# EAGLE schematic ctia_alone (EAGLE 7.2.0)
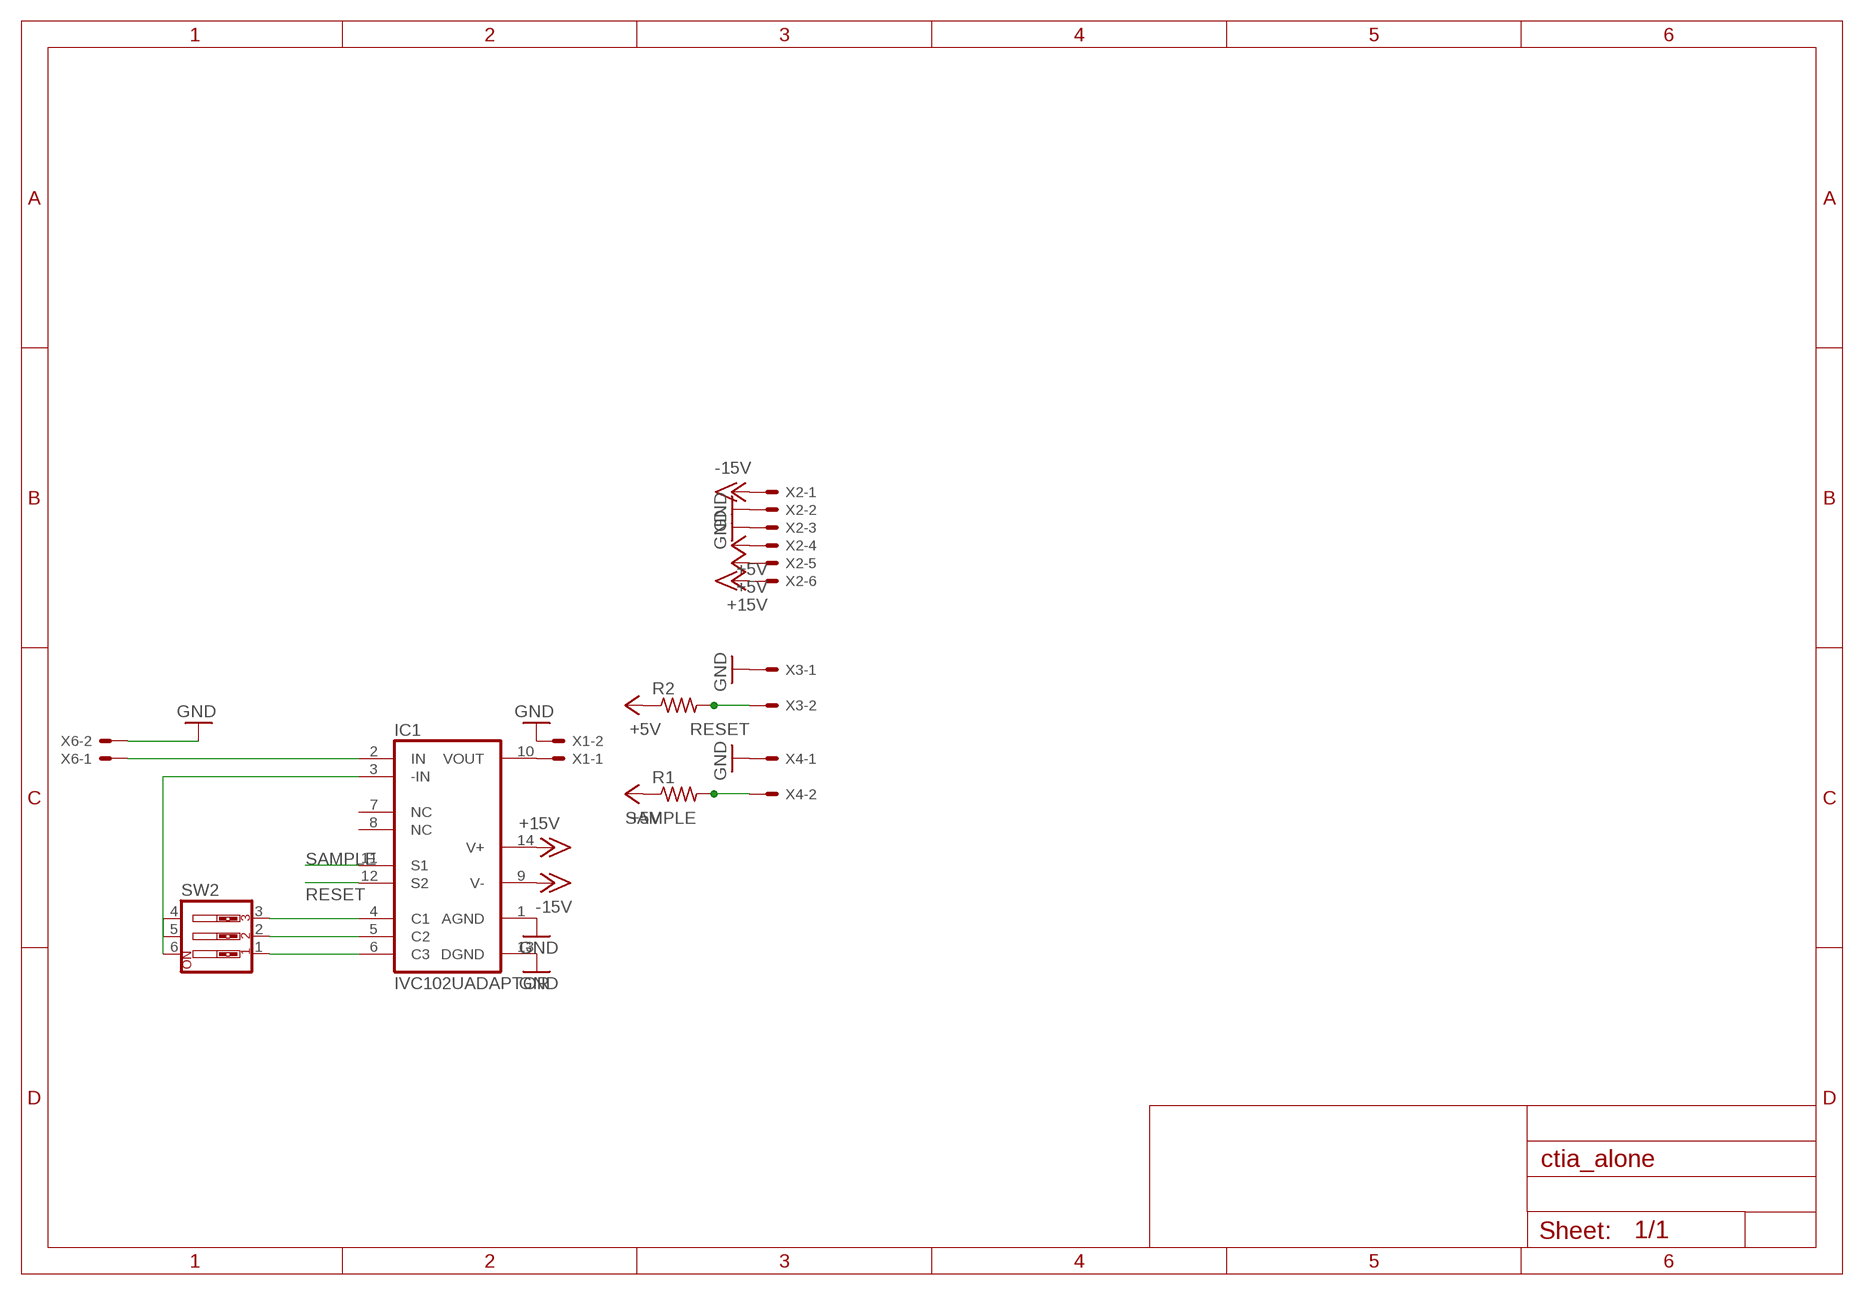
[diagram p0: schematic, sheet 1]

## Parts
IC1  IVC102UADAPTOR  [DIL14]
R1  R-US_0207/12  [0207/12]
R2  R-US_0207/10  [0207/10]
SW2  SW_DIP-3  [EDG-03]
X1  KK-156-2  [KK-156-2]
X2  KK-156-6  [KK-156-6]
X3  KK-156-2  [KK-156-2]
X4  KK-156-2  [KK-156-2]
X6  KK-156-2  [KK-156-2]

## Nets
+5V: R1.1 R2.1 X2.4 X2.5
+15V: IC1.14(V+) X2.6
-15V: IC1.9(V-) X2.1
GND: IC1.1(AGND) IC1.13(DGND) X1.2 X2.2 X2.3 X3.1 X4.1 X6.2
N$1: IC1.6(C3) SW2.1
N$2: IC1.5(C2) SW2.2
N$3: IC1.4(C1) SW2.3
N$4: IC1.3(-IN) SW2.4 SW2.5 SW2.6
N$5: IC1.2(IN) X6.1
N$6: IC1.10(VOUT) X1.1
RESET: IC1.12(S2) R2.2 X3.2
SAMPLE: IC1.11(S1) R1.2 X4.2
Unconnected: IC1.7(NC) IC1.8(NC)

## Library data of the parts
IC1 = burr-brown:IVC102U: Amplifier Precision Switched Integrator Transimpedance
R1 R2 = resistor:R-US_: RESISTOR, American symbol
SW2 = special:SW_DIP-3: DIP SWITCH
X1 X3 X4 X6 = con-molex:KK-156-2: KK 156 HEADER Source: http://www.molex.com/pdm_docs/sd/026604100_sd.pdf; OC_FARNELL: unknown; OC_NEWARK: unknown
X2 = con-molex:KK-156-6: KK 156 HEADER Source: http://www.molex.com/pdm_docs/sd/026604100_sd.pdf; OC_FARNELL: unknown; OC_NEWARK: unknown